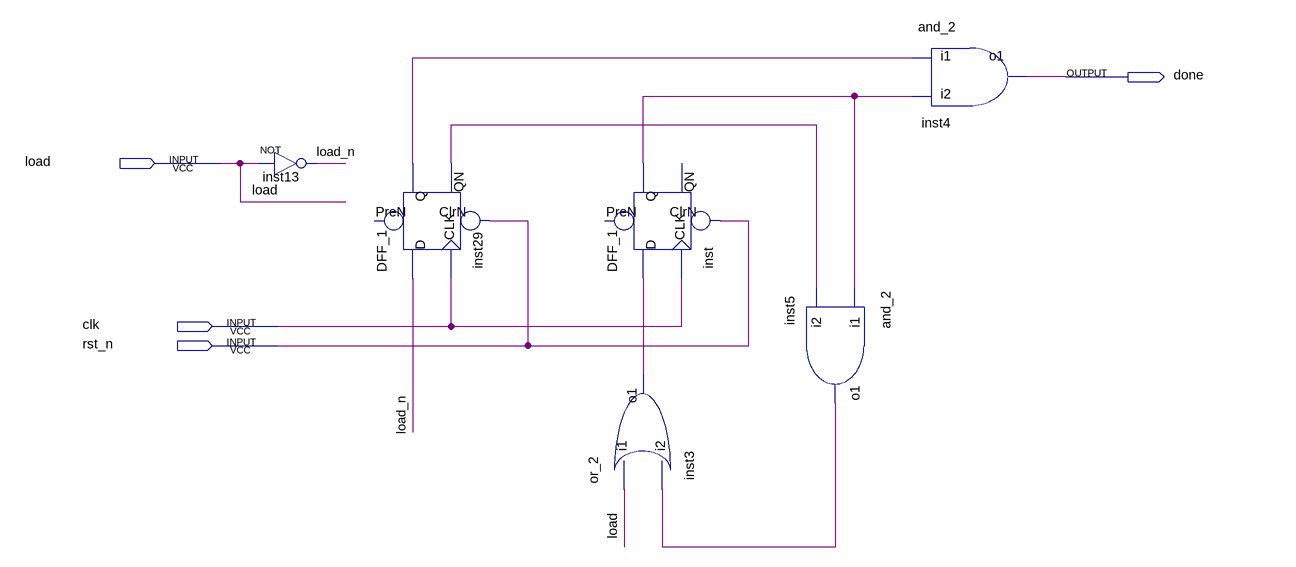
[diagram p0: schematic sheet]
// Quartus schematic FSM.bdf as structural Verilog: 6 symbols, 4 pins
module FSM (
  input  load,
  input  clk,
  input  rst_n,
  output done
);

  wire inst3_o1, inst5_o1, inst29_q, inst29_qn, inst_q, load_n;

  not inst13 (load_n, load);
  DFF_1 inst29 (.CLK(clk), .D(load_n), .ClrN(rst_n), .QN(inst29_qn), .Q(inst29_q));  // open: PreN
  DFF_1 inst (.CLK(clk), .D(inst3_o1), .ClrN(rst_n), .Q(inst_q));  // open: PreN, QN
  or_2 inst3 (.i1(load), .i2(inst5_o1), .o1(inst3_o1));
  and_2 inst5 (.i1(inst_q), .i2(inst29_qn), .o1(inst5_o1));
  and_2 inst4 (.i1(inst29_q), .i2(inst_q), .o1(done));
endmodule
